# EasyEDA Pro project 15届省2.epro

# Schematic SCH

## Sheets
1 P1: Create Date: 2024-03-08; Page Name: P1; Project Name: 15P2D_EDA; Schematic Name: SCH; Update Date: 2024-04-16; Company: 嘉立创EDA; Page Size: A4; Version: V1.0
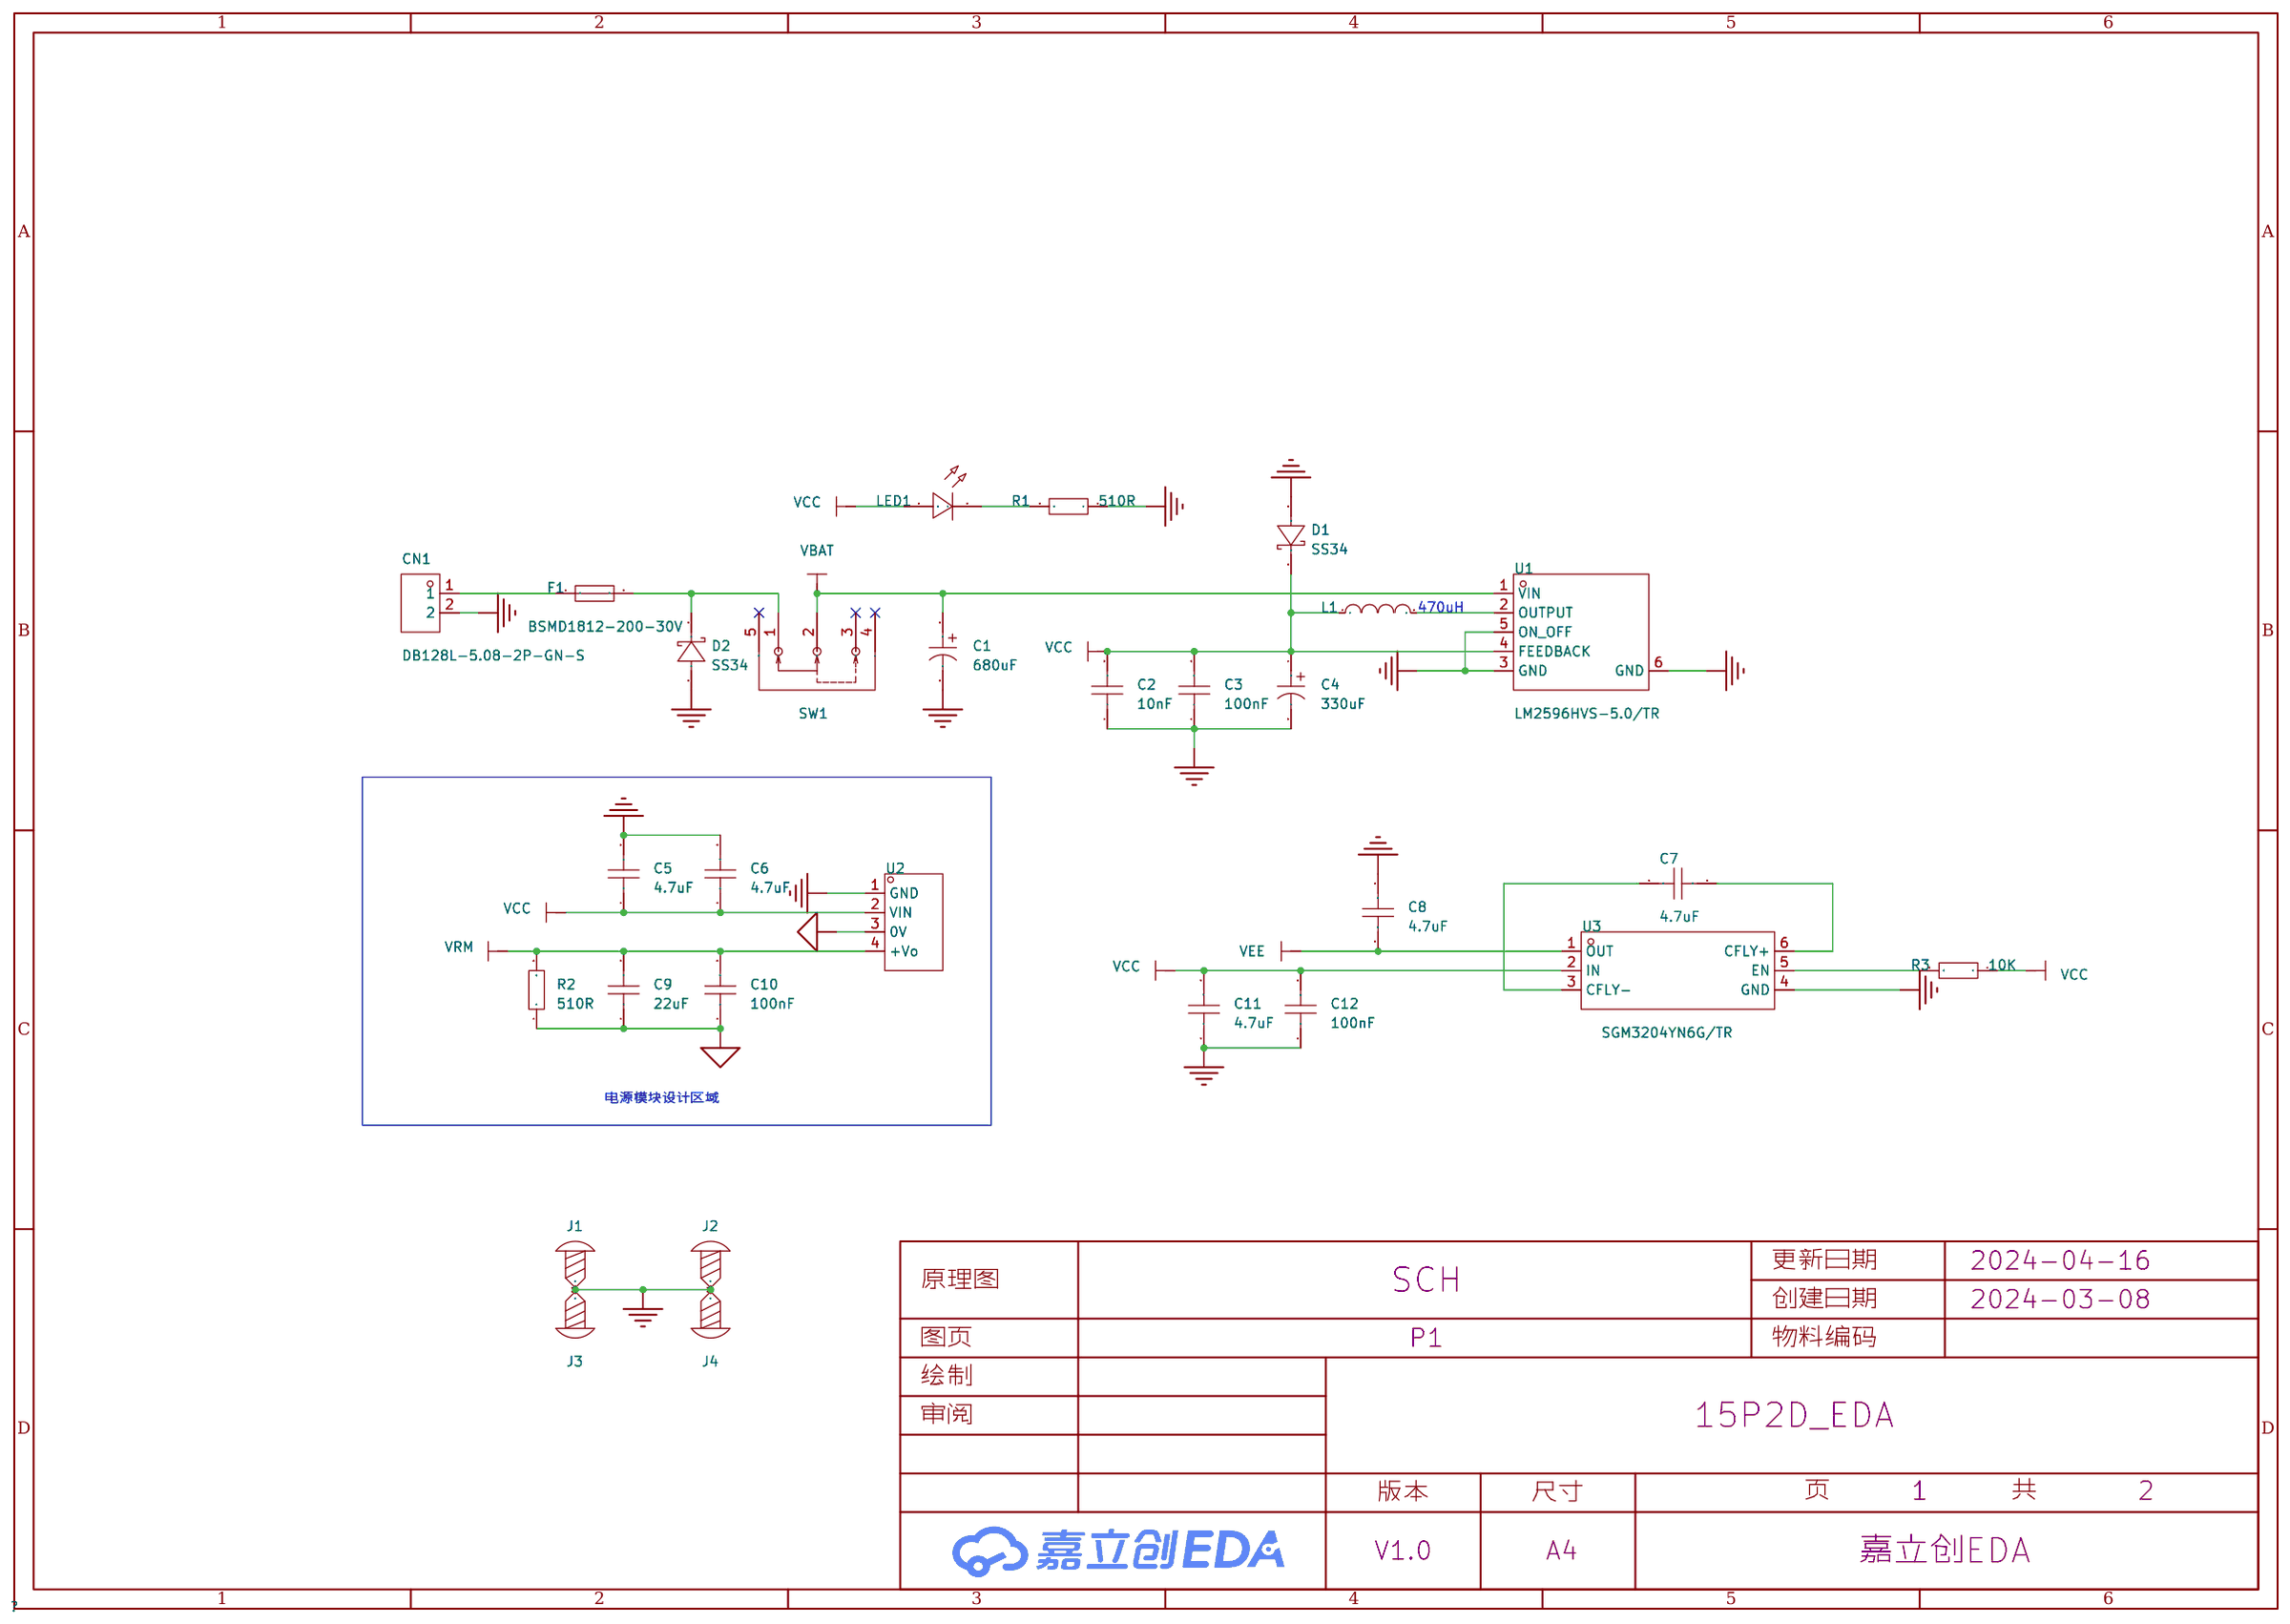
[diagram p0: P1]
2 P2: Create Date: 2024-03-11; Page Name: P2; Update Date: 2024-04-10; Company: EDA设计与开发
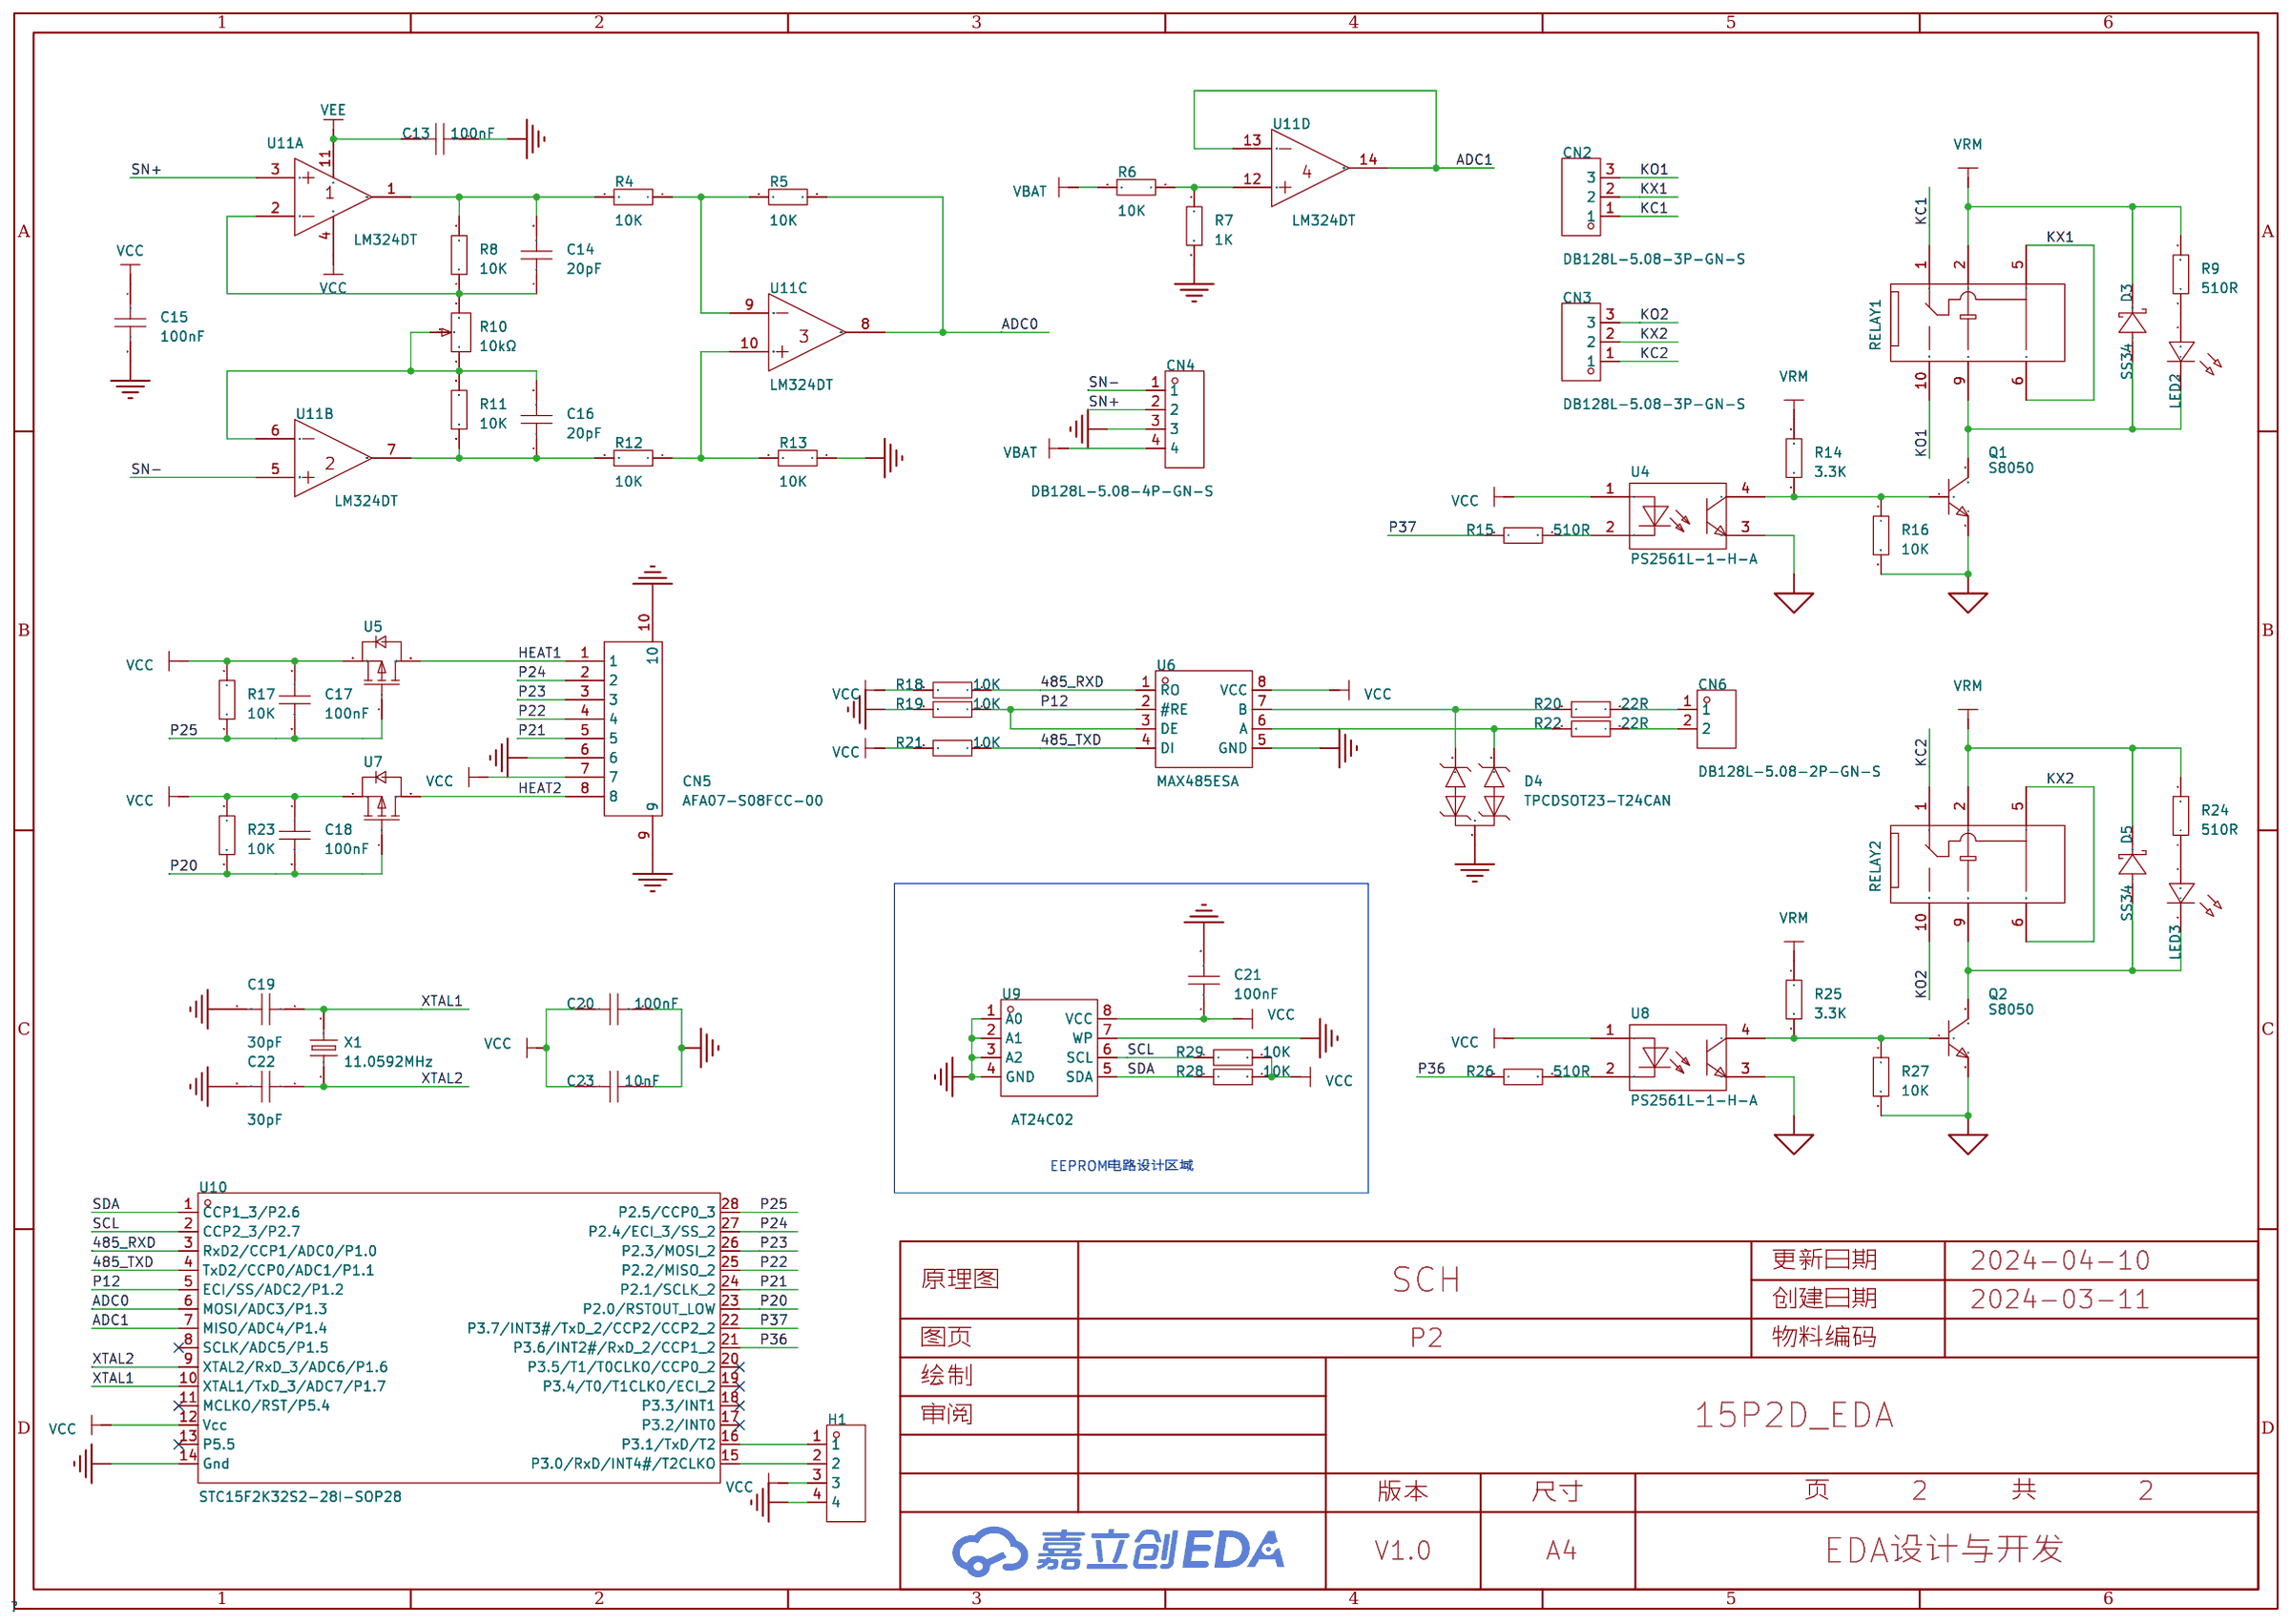
[diagram p1: P2]

## Parts
sheet P1
C1  680uF  [CAP-SMD_BD10.0-L10.3-W10.3-LS11.3-FD]
C2  10nF  [C0805]
C3  100nF  [C0805]
C4  330uF  [CAP-SMD_BD6.3-L6.6-W6.6-LS7.6-RD]
C5  4.7uF  [C1206]
C6  4.7uF  [C1206]
C7  4.7uF  [C1206]
C8  4.7uF  [C1206]
C9  22uF  [C1206]
C10  100nF  [C0805]
C11  4.7uF  [C1206]
C12  100nF  [C0805]
CN1  DB128L-5.08-2P-GN-S  [CONN-TH_2P-P5.08_DB128L-5.08-2P]
D1  SS34  [SMA_L4.3-W2.5-LS5.0-RD]
D2  SS34  [SMA_L4.3-W2.5-LS5.0-RD]
F1  BSMD1812-200-30V  [F1812]
J1  -  [M2螺丝]
J2  -  [M2螺丝]
J3  -  [M2螺丝]
J4  -  [M2螺丝]
L1  470uH  [IND-SMD_L12.0-W12.0_YPRH120X]
LED1  -  [LED_TH-3mm]
R1  510R  [R0805]
R2  510R  [R0805]
R3  10K  [R0805]
SW1  SK12D07VG4  [SW-TH_SK12D07VG4]
U1  LM2596HVS-5.0/TR  [TO-263-5_L10.2-W8.9-P1.70-LS15.2-BR]
U2  -  [TH_PCON]
U3  SGM3204YN6G/TR  [SOT-23-6_L2.9-W1.6-P0.95-LS2.8-BR]
sheet P2
C13  100nF  [C0805]
C14  20pF  [C0805]
C15  100nF  [C0805]
C16  20pF  [C0805]
C17  100nF  [C0805]
C18  100nF  [C0805]
C19  30pF  [C0805]
C20  100nF  [C0805]
C21  100nF  [C0805]
C22  30pF  [C0805]
C23  10nF  [C0805]
CN2  DB128L-5.08-3P-GN-S  [CONN-TH_DB128L-5.08-3P]
CN3  DB128L-5.08-3P-GN-S  [CONN-TH_DB128L-5.08-3P]
CN4  DB128L-5.08-4P-GN-S  [CONN-TH_4P_DB128L-5.08-4P-GN-S]
CN5  AFA07-S08FCC-00  [FPC-SMD_P1.00-8P_LCS-XJ-H2.5]
CN6  DB128L-5.08-2P-GN-S  [CONN-TH_2P-P5.08_DB128L-5.08-2P]
D3  SS34  [SMA_L4.3-W2.5-LS5.0-RD]
D4  TPCDSOT23-T24CAN  [SOT-23-3_L2.9-W1.3-P1.90-LS2.4-BR]
D5  SS34  [SMA_L4.3-W2.5-LS5.0-RD]
H1  -  [HDR-TH_4P-P2.54-V-F]
LED2  -  [LED_TH-3mm]
LED3  -  [LED_TH-3mm]
Q1  S8050  [SOT-23-3_L2.9-W1.3-P1.90-LS2.4-BR]
Q2  S8050  [SOT-23-3_L2.9-W1.3-P1.90-LS2.4-BR]
R4  10K  [R0805]
R5  10K  [R0805]
R6  10K  [R0805]
R7  1K  [R0805]
R8  10K  [R0805]
R9  510R  [R0805]
R10  10kΩ  [RES-ADJ-TH_3P-L10.0-W10.0-P2.50-BL-BS]
R11  10K  [R0805]
R12  10K  [R0805]
R13  10K  [R0805]
R14  3.3K  [R0805]
R15  510R  [R0805]
R16  10K  [R0805]
R17  10K  [R0805]
R18  10K  [R0805]
R19  10K  [R0805]
R20  22R  [R0805]
R21  10K  [R0805]
R22  22R  [R0805]
R23  10K  [R0805]
R24  510R  [R0805]
R25  3.3K  [R0805]
R26  510R  [R0805]
R27  10K  [R0805]
R28  10K  [R0805]
R29  10K  [R0805]
RELAY1  G5V-1 DC5  [RELAY-TH_G5V-1]
RELAY2  G5V-1 DC5  [RELAY-TH_G5V-1]
U4  PS2561L-1-H-A  [SOP-4_L6.5-W4.6-P2.54-LS9.6-TL]
U5  SI2301-ZE  [SOT-23-3_L2.9-W1.3-P1.90-LS2.4-BR]
U6  MAX485ESA  [SOP-8_L5.0-W4.0-P1.27-LS6.0-BL]
U7  SI2301-ZE  [SOT-23-3_L2.9-W1.3-P1.90-LS2.4-BR]
U8  PS2561L-1-H-A  [SOP-4_L6.5-W4.6-P2.54-LS9.6-TL]
U9  AT24C02  [SOP-8_L4.9-W3.9-P1.27-LS6.0-BL]
U10  STC15F2K32S2-28I-SOP28  [SOP-28_L17.9-W7.5-P1.27-LS10.3-BL]
U11  LM324DT  [SOIC-14_L8.7-W3.9-P1.27-LS6.0-BL]  (sections 1,2,3,4)
X1  11.0592MHz  [HC-49US_L11.5-W4.5-P4.88]

## Library data of the parts
C1 = 126RV0105: 容值:680uF;精度:±20%;额定电压:35V;纹波电流:380mA;; LCSC Part Name: 680uF ±20% 35V; Supplier Part: C7461236; Manufacturer: KNSCHA(科尼盛); Supplier Footprint: SMD,D10xL10.5mm; JLCPCB Part Class: Extended Part; Datasheet: https://atta.szlcsc.com/upload/public/pdf/source/20230711/6451BDCB5B323B6F7EF00B061BF0BEEC.pdf; Supplier: LCSC; Tolerance: ±20%; Rated Voltage: 35V; Ripple Current: 380mA; φD: 10mm; L: 10.5mm; Lifetime @ Temp: 2000hrs@105℃; Operating Temperature: -55℃~+105℃
C2 C3 C10 C12-C23 = CAP_0805: Supplier Footprint: 0805
C4 = 126RV0107: 容值:330uF;精度:±20%;额定电压:16V;纹波电流:170mA;; LCSC Part Name: 330uF ±20% 16V; Supplier Part: C7461238; Manufacturer: KNSCHA(科尼盛); Supplier Footprint: SMD,D6.3xL7.7mm; JLCPCB Part Class: Extended Part; Datasheet: https://atta.szlcsc.com/upload/public/pdf/source/20230711/6451BDCB5B323B6F7EF00B061BF0BEEC.pdf; Supplier: LCSC; Tolerance: ±20%; Rated Voltage: 16V; Ripple Current: 170mA; φD: 6.3mm; L: 7.7mm; Lifetime @ Temp: 2000hrs@105℃; Operating Temperature: -55℃~+105℃
C5-C9 C11 = CL31A226KOHNNNE: 容值:22uF;精度:±10%;额定电压:16V;材质(温度系数):X5R;; LCSC Part Name: 22uF ±10% 16V; Supplier Part: C90146; Manufacturer: SAMSUNG(三星); Supplier Footprint: 1206; JLCPCB Part Class: 扩展库; Datasheet: https://atta.szlcsc.com/upload/public/pdf/source/20161228/1482890861309.pdf; Supplier: LCSC; Tolerance: ±10%; Voltage Rated: 16V; Temperature Coefficient: X5R
CN1 CN6 = DB128L-5.08-2P-GN-S: 结构:1x2P;间距:5.08mm;颜色:绿色;安装方式:直插;额定电流:18A;额定电压:250V;排数:1;线规 - AWG:12~30;线规 - 平方毫米:2.5;每排PIN数:2;工作温度范围:-40℃~+105℃;; LCSC Part Name: 5.08mm 1x2P 排数:1 每排P数:2 直插; Supplier Part: C395868; Manufacturer: DORABO(地博电气); Supplier Footprint: 插件,P=5.08mm; JLCPCB Part Class: 扩展库; Datasheet: https://atta.szlcsc.com/upload/public/pdf/source/20230106/B067FE0E641A396A370D47F93C345689.pdf; Supplier: LCSC; Structure: 1x2P; Pitch: 5.08mm; Color: 绿色; Mounting Style: 直插; Current Rating (Max): 18A; Voltage Rating (Max): 250V; Number of Pins: 2P; Number of Rows: 1; Wire Gauge - AWG: 12~30; Wire Gauge - mm2: 2.5; Number of PINs Per Row: 2; Operating Temperature Range: -40℃~+105℃
D1-D3 D5 = SS34_C727060: 二极管配置:独立式;正向压降(Vf):550mV@3A;直流反向耐压(Vr):40V;平均整流电流(Io):3A;; LCSC Part Name: 电压:40V 电流:3A; Supplier Part: C727060; Manufacturer: TWGMC(台湾迪嘉); Supplier Footprint: SMA(DO-214AC); JLCPCB Part Class: 扩展库; Datasheet: https://atta.szlcsc.com/upload/public/pdf/source/20200828/C727059_6599B6CAC5F3238B9C33E46794659DBE.pdf; Supplier: LCSC; Diode Configuration: 独立式; Forward Voltage (Vf@If): 550mV@3A; Reverse Voltage (Vr): 40V; Average Rectified Current (Io): 3A; Reverse Leakage Current (Ir): 500uA@40V
F1 = BSMD1812-200-30V: 最大电压:30V;最大电流:40A;保持电流:2A;跳闸电流:4A;; LCSC Part Name: 30V 2A 1812自恢复; Supplier Part: C960026; Manufacturer: BHFUSE(佰宏); Supplier Footprint: 1812; JLCPCB Part Class: 扩展库; Datasheet: https://atta.szlcsc.com/upload/public/pdf/source/20230512/6ED7FF50F668B3AF958C55F12246A840.pdf; Supplier: LCSC; Operating Voltage (Max): 30V; Current Rating (Max): 40A; Hold Current: 2A; Trip Current: 4A; Power Dissipation: 1W; Resistance - Initial (Ri) (Min): 20mΩ; Resistance - Post Trip (R1) (Max): 100mΩ; Maximum Time to Trip: 2s; Operating Temperature: -40℃~+85℃
J1-J4 = M2螺丝: Supplier Footprint: 插件
L1 = YPRH1209-471M: 电感值:470uH;精度:±20%;额定电流:1.06A;; LCSC Part Name: 470uH ±20%; Supplier Part: C718309; Manufacturer: YJYCOIN(益嘉源); Supplier Footprint: SMD,12x12mm; JLCPCB Part Class: 扩展库; Datasheet: https://atta.szlcsc.com/upload/public/pdf/source/20200623/C339955_D39FA66995A9BB8553FDBD7D9E6E5CB5.pdf; Supplier: LCSC; Tolerance: ±20%; Rated Current: 1.06A; DC Resistance (DCR): 471mΩ
LED1 = LED_TH-R_3mm: Supplier Footprint: 插件
R1-R9 R11-R29 = Res_0805: Supplier Footprint: 0805
SW1 = SK12D07VG4: 电路结构:单刀双掷;安装方式:侧插;额定电流(DC):500mA;额定电压(DC):50V;额定电流(AC):-;额定电压(AC):-;机械寿命:5千次;; LCSC Part Name: 3脚2档位 卧插 滑动开关; Supplier Part: C393937; Manufacturer: SHOU HAN(首韩); Supplier Footprint: 插件; JLCPCB Part Class: 扩展库; Datasheet: https://atta.szlcsc.com/upload/public/pdf/source/20190521/C393937_939FE26E571CC67D2D532E953108A1B0.pdf; Supplier: LCSC; Circuit: 单刀双掷; Actuator Style: 矩形柱状; Pin Style: PC引脚; Switch Height: 8.8mm; Mounting Style: 侧插; Current Rating (DC): 500mA; Voltage Rating (DC): 50V; Mechanical Life: 5千次
U1 = LM2596HVS-5.0/TR: Supplier Part: C7421039; Manufacturer: HGSEMI(华冠); Supplier Footprint: TO-263-5; Datasheet: https://atta.szlcsc.com/upload/public/pdf/source/20230608/50F81A07F1CB4120FC66F79925E72406.pdf; Supplier: LCSC
U2 = PCON
U3 = SGM3204YN6G/TR: 功能类型:-;输入电压:1.4V~5.5V;输出电压:-5.5V~-1.4V;输出电流(最大值):200mA;; Supplier Part: C194031; Manufacturer: SGMICRO(圣邦微); Supplier Footprint: SOT-23-6; JLCPCB Part Class: 扩展库; Datasheet: https://atta.szlcsc.com/upload/public/pdf/source/20180627/C194031_755051E53122D645C36CF727711B963E.pdf; Supplier: LCSC; Input Voltage: 1.4V~5.5V; Output Voltage: -5.5V~-1.4V; Output Current (Max): 200mA; Switching Frequency: 950kHz; Number of Outputs: 1; Switch tube (built-in/external): 内置
CN2 CN3 = DB128L-5.08-3P-GN-S: 结构:1x3P;间距:5.08mm;颜色:绿色;安装方式:直插;额定电流:18A;额定电压:250V;排数:1;线规 - AWG:12~30;线规 - 平方毫米:2.5;每排PIN数:3;工作温度范围:-40℃~+105℃;; LCSC Part Name: 5.08mm 1x3P 排数:1 每排P数:3 直插; Supplier Part: C395869; Manufacturer: DORABO(地博电气); Supplier Footprint: 插件,P=5.08mm; JLCPCB Part Class: 扩展库; Datasheet: https://atta.szlcsc.com/upload/public/pdf/source/20230106/B067FE0E641A396A370D47F93C345689.pdf; Supplier: LCSC; Structure: 1x3P; Pitch: 5.08mm; Color: 绿色; Mounting Style: 直插; Current Rating (Max): 18A; Voltage Rating (Max): 250V; Number of Pins: 3P; Number of Rows: 1; Wire Gauge - AWG: 12~30; Wire Gauge - mm2: 2.5; Number of PINs Per Row: 3; Operating Temperature Range: -40℃~+105℃
CN4 = DB128L-5.08-4P-GN-S: 结构:1x4P;间距:5.08mm;颜色:绿色;安装方式:直插;额定电流:18A;额定电压:250V;排数:1;线规 - AWG:12~30;线规 - 平方毫米:2.5;每排PIN数:4;工作温度范围:-40℃~+105℃;; LCSC Part Name: 5.08mm 1x4P 排数:1 每排P数:4 直插; Supplier Part: C2827883; Manufacturer: DORABO(地博电气); Supplier Footprint: 插件,P=5.08mm; JLCPCB Part Class: 扩展库; Datasheet: https://atta.szlcsc.com/upload/public/pdf/source/20230106/B067FE0E641A396A370D47F93C345689.pdf; Supplier: LCSC; Structure: 1x4P; Pitch: 5.08mm; Color: 绿色; Mounting Style: 直插; Current Rating (Max): 18A; Voltage Rating (Max): 250V; Number of Pins: 4P; Number of Rows: 1; Wire Gauge - AWG: 12~30; Wire Gauge - mm2: 2.5; Number of PINs Per Row: 4; Operating Temperature Range: -40℃~+105℃
CN5 = AFA07-S08FCC-00: 锁定特性:抽屉式;触点类型:下接;触点数量:8P;间距:1mm;安装类型:卧贴;; LCSC Part Name: 间距:1mm P数:8P 抽屉式 下接; Supplier Part: C262342; Manufacturer: JS(钜硕电子); Supplier Footprint: SMD,P=1mm,卧贴; JLCPCB Part Class: 扩展库; Datasheet: https://atta.szlcsc.com/upload/public/pdf/source/20191217/C262716_30B15E9A77BFCA4A54741C92DB3BE8CC.pdf; Supplier: LCSC; Locking Feature: 抽屉式; Contact Type: 下接; Number of Contacts: 8P; Pitch: 1mm; Mounting Type: 卧贴; FFC, FCB Thickness: 0.3mm; Height Above Board: 2.5mm
D4 = TPCDSOT23-T24CAN: Supplier Part: C970033; Manufacturer: TECH PUBLIC(台舟); Supplier Footprint: SOT-23; JLCPCB Part Class: 扩展库; Datasheet: https://atta.szlcsc.com/upload/public/pdf/source/20230522/C1F3B36253468277A14BE124FFAB154C.pdf; Supplier: LCSC
H1 = HDR-F_2.54_1x4P: Supplier Part: C2718488; Supplier Footprint: 插件
LED2 LED3 = LED_TH-G_3mm: Supplier Footprint: 插件
Q1 Q2 = S8050_C2891804: 晶体管类型:NPN;集电极电流(Ic):500mA;集射极击穿电压(Vceo):25V;功率(Pd):300mW;; LCSC Part Name: NPN 电流:500mA 耐压:25V; Supplier Part: C2891804; Manufacturer: YONGYUTAI(永裕泰); Supplier Footprint: SOT-23; JLCPCB Part Class: Extended Part; Datasheet: https://atta.szlcsc.com/upload/public/pdf/source/20210901/5347316A10609C628D4D69AE01446E5B.pdf; Supplier: LCSC; Transistor Type: NPN; Collector Current (Ic): 500mA; Collector-Emitter Breakdown Voltage (Vceo): 25V; Power Dissipation (Pd): 300mW; Collector Cut-Off Current (Icbo): 1uA; Collector-Emitter Saturation Voltage (VCE(sat)@Ic,Ib): 500mV@500mA,50mA
R10 = 3296W-1-203LF: 阻值:20kΩ;精度:±10%;功率:500mW;温度系数:±100ppm/℃;; LCSC Part Name: 20kΩ ±10%; Supplier Part: C34845; Manufacturer: BOURNS; Supplier Footprint: 插件; JLCPCB Part Class: 扩展库; Datasheet: https://atta.szlcsc.com/upload/public/pdf/source/20151026/1457707506403.pdf; Supplier: LCSC; Tolerance: ±10%; Power(Watts): 500mW; Temperature Coefficient: ±100ppm/℃; Turns: 25
RELAY1 RELAY2 = G5V-1 DC5: 线圈电压:5V;触点形式:一组转换:1C(单刀双掷-转换);触点容量(电阻负载):-;最大切换电压:125V@AC；60V@DC;最大切换电流:1A;; LCSC Part Name: 继电器G5V-1-5VDC; Supplier Part: C28695; Manufacturer: OMRON(欧姆龙); Supplier Footprint: DIP,7.5x12.5mm; JLCPCB Part Class: 扩展库; Supplier: LCSC; Coil Voltage: 5V; Contact Form: 一组转换:1C(单刀双掷-转换); Maximum Switching Voltage: 125V@AC；60V@DC; Contact Material: 银+镀金; Maximum Switching Current: 1A; Operate Time: 5ms; Release Time: 5ms; Operating Temperature: -40℃~+70℃
U4 U8 = PS2561L-1-H-A: Supplier Part: C145672; Manufacturer: California Eastern Laboratories; Supplier Footprint: SOP-4-2.54mm; JLCPCB Part Class: 扩展库; Datasheet: https://atta.szlcsc.com/upload/public/pdf/source/20180125/C145673_15168615431091301608.pdf; Supplier: LCSC
U5 U7 = SI2301-ZE: 类型:P沟道;漏源电压(Vdss):20V;连续漏极电流(Id):2.3A;功率(Pd):700mW;导通电阻(RDS(on)@Vgs,Id):126mΩ@4.5V;阈值电压(Vgs(th)@Id):1V@250uA;; LCSC Part Name: P沟道 耐压:20V 电流:2.3A; Supplier Part: C5261052; Manufacturer: HXY MOSFET(华轩阳电子); Supplier Footprint: SOT-23; JLCPCB Part Class: 扩展库; Datasheet: https://atta.szlcsc.com/upload/public/pdf/source/20230515/2FF2907841563ED329594D3237822724.pdf; Supplier: LCSC; Type: P沟道; Drain Source Voltage (Vdss): 20V; Continuous Drain Current (Id): 2.3A; Power Dissipation (Pd): 700mW; Drain Source On Resistance (RDS(on)@Vgs,Id): 126mΩ@4.5V; Gate Threshold Voltage (Vgs(th)@Id): 1V@250uA; Input Capacitance (Ciss@Vds): 285pF
U6 = MAX485ESA_C668206: Supplier Part: C668206; Manufacturer: UMW(友台半导体); Supplier Footprint: SOP-8; JLCPCB Part Class: 扩展库; Datasheet: https://atta.szlcsc.com/upload/public/pdf/source/20231109/489730AE87B90C4B6B8CE65C07B1054C.pdf; Supplier: LCSC
U9 = AT24C02_C7470930: 接口类型:I2C;存储容量:2Kbit;时钟频率(fc):400kHz~1MHz;; LCSC Part Name: AT24C02  2Kbit 12C; Supplier Part: C7470930; Manufacturer: HXY MOSFET(华轩阳电子); Supplier Footprint: SOP-8; JLCPCB Part Class: 扩展库; Datasheet: https://atta.szlcsc.com/upload/public/pdf/source/20230913/748AF0FF0068DF582FAC58AD968E8A28.pdf; Supplier: LCSC; Interface Type: I2C; Memory Size: 2Kbit; Clock Frequency (fc): 400kHz~1MHz; Supply Voltage: 1.8V~5.5V; Data Retention - TDR (Year): 100年
U10 = STC15F2K32S2-28I-SOP28: LCSC Part Name: STC15F2K32S2-28I- SOP28; Supplier Part: C194605; Manufacturer: STC(宏晶); Supplier Footprint: SOP-28-300mil; JLCPCB Part Class: 扩展库; Datasheet: https://atta.szlcsc.com/upload/public/pdf/source/20180730/C194606_29BB2C4DE21484D9E9511E7CB40FB26F.pdf; Supplier: LCSC
U11 = LM324DT: 放大器数:四路;增益带宽积(GBP):1.3MHz;输入偏置电流(Ib):20nA;压摆率(SR):0.4V/us;带宽(-3db):-;; Supplier Part: C71035; Manufacturer: ST(意法半导体); Supplier Footprint: SOIC-14; JLCPCB Part Class: 基础库; Datasheet: https://atta.szlcsc.com/upload/public/pdf/source/20160408/1460100649718.pdf; Supplier: LCSC; Number of Circuits: 四路; Gain Bandwidth Product(GBP): 1.3MHz; Current - Input Bias(Ib): 20nA; Slew Rate(SR): 0.4V/us; Output Current: 40mA; Supply Current: 1.5mA; Operating Temperature: 0℃~+70℃
X1 = TAXD11.0592M2GLFBET2T: 晶振类型:直插晶振;频率:11.0592MHz;常温频差:±30ppm;外接负载电容:20pF;频率稳定度(全温):±30ppm;; LCSC Part Name: 11.0592MHz ±30ppm 20pF; Supplier Part: C127675; Manufacturer: YJX(雅晶鑫); Supplier Footprint: HC-49S; JLCPCB Part Class: 扩展库; Datasheet: https://atta.szlcsc.com/upload/public/pdf/source/20170914/C127676_1505359415156967690.pdf; Supplier: LCSC; Crystal Type: 直插晶振; Normal temperature Frequency Tolerance: ±30ppm; External load capacitor: 20pF; Frequency Stability(Full temperature range): ±30ppm; Equivalent Series Resistance (ESR): 50Ω; Operating Temperature: -20℃~+70℃

## Nets
GND: C1.2 C2.1 C3.1 C4.2 C5.2 C6.2 C8.1 C11.1 C12.1 C13.1 C15.2 C19.2 C20.1 C21.2 C22.2 C23.1 CN1.2 CN4.3 CN5.6 CN5.9 CN5.10 D1.2(A) D2.2(A) D4.3 H1.4 J1.1 J2.1 J3.1 J4.1 R1.1 R7.2 R13.1 R19.2 U1.3(GND) U1.5(ON_OFF) U1.6(GND) U2.1(GND) U3.4(GND) U6.5(GND) U9.1(A0) U9.2(A1) U9.3(A2) U9.4(GND) U9.7(WP) U10.14(Gnd)
VBAT: C1.1 CN4.4 R6.2 SW1.2 U1.1(VIN)
VCC: C2.2 C3.2 C4.1 C5.1 C6.1 C11.2 C12.2 C15.1 C17.1 C18.1 C20.2 C21.1 C23.2 CN5.7 D1.1(C) H1.3 L1.1 LED1.1(C) R3.1 R17.1 R18.2 R21.2 R23.1 R28.2 R29.2 U1.4(FEEDBACK) U2.2(VIN) U3.2(IN) U4.1 U5.2(S) U6.8(VCC) U7.2(S) U8.1 U9.8(VCC) U10.12(Vcc) U11.4(VCC+)
VEE: C8.2 C13.2 U3.1(OUT) U11.11(VCC-)
0: C9.1 C10.1 Q1.2(E) Q2.2(E) R2.1 R16.2 R27.2 U2.3(0V) U4.3 U8.3
485_RXD: R18.1 U6.1(RO) U10.3(RxD2/CCP1/ADC0/P1.0)
485_TXD: R21.1 U6.4(DI) U10.4(TxD2/CCP0/ADC1/P1.1)
ADC0: R5.1 U10.6(MOSI/ADC3/P1.3) U11.8(OUT3)
ADC1: U10.7(MISO/ADC4/P1.4) U11.13(IN4-) U11.14(OUT4)
HEAT1: CN5.1 U5.3(D)
HEAT2: CN5.8 U7.3(D)
KC1: CN2.1 RELAY1.1
KC2: CN3.1 RELAY2.1
KO1: CN2.3 RELAY1.10
KO2: CN3.3 RELAY2.10
KX1: CN2.2 RELAY1.5 RELAY1.6
KX2: CN3.2 RELAY2.5 RELAY2.6
P12: R19.1 U6.2(#RE) U6.3(DE) U10.5(ECI/SS/ADC2/P1.2)
P20: C18.2 R23.2 U7.1(G) U10.23(P2.0/RSTOUT_LOW)
P21: CN5.5 U10.24(P2.1/SCLK_2)
P22: CN5.4 U10.25(P2.2/MISO_2)
P23: CN5.3 U10.26(P2.3/MOSI_2)
P24: CN5.2 U10.27(P2.4/ECI_3/SS_2)
P25: C17.2 R17.2 U5.1(G) U10.28(P2.5/CCP0_3)
P36: R26.1 U10.21(P3.6/INT2#/RxD_2/CCP1_2)
P37: R15.1 U10.22(P3.7/INT3#/TxD_2/CCP2/CCP2_2)
SCL: R29.1 U9.6(SCL) U10.2(CCP2_3/P2.7)
SDA: R28.1 U9.5(SDA) U10.1(CCP1_3/P2.6)
SN+: CN4.2 U11.3(IN1+)
SN-: CN4.1 U11.5(IN2+)
VRM: C9.2 C10.2 D3.1(C) D5.1(C) R2.2 R9.2 R14.1 R24.2 R25.1 RELAY1.2 RELAY2.2 U2.4(+Vo)
XTAL1: C19.1 U10.10(XTAL1/TxD_3/ADC7/P1.7) X1.2
XTAL2: C22.1 U10.9(XTAL2/RxD_3/ADC6/P1.6) X1.1
$1N5406: CN1.1 F1.1
$1N6010: L1.2 U1.2(OUTPUT)
$1N7874: R3.2 U3.5(EN)
$1N8048: C7.2 U3.6(CFLY+)
$1N8053: C7.1 U3.3(CFLY-)
$1N8284: LED1.2(A) R1.2
$1N8627: D2.1(C) F1.2 SW1.1
$2N2031: C16.1 R11.1 R12.2 U11.7(OUT2)
$2N2092: R12.1 R13.2 U11.10(IN3+)
$2N2099: R4.1 R5.2 U11.9(IN3-)
$2N2266: C14.1 R8.1 R10.1 U11.2(IN1-)
$2N2273: C14.2 R4.2 R8.2 U11.1(OUT1)
$2N2314: C16.2 R10.2 R10.3 R11.2 U11.6(IN2-)
$2N3023: CN6.1 R20.1
$2N3053: CN6.2 R22.1
$2N3244: D4.1 R22.2 U6.6(A)
$2N3251: D4.2 R20.2 U6.7(B)
$2N3377: R15.2 U4.2
$2N3466: Q1.1(B) R14.2 R16.1 U4.4
$2N4164: R26.2 U8.2
$2N4168: Q2.1(B) R25.2 R27.1 U8.4
$2N4738: LED2.1(C) R9.1
$2N4742: D3.2(A) LED2.2(A) Q1.3(C) RELAY1.9
$2N4893: LED3.1(C) R24.1
$2N4914: D5.2(A) LED3.2(A) Q2.3(C) RELAY2.9
$2N5025: R6.1 R7.1 U11.12(IN4+)
$2N7138: H1.1 U10.16(P3.1/TxD/T2)
$2N7141: H1.2 U10.15(P3.0/RxD/INT4#/T2CLKO)

Not connected (* = marked no-connect by the designer): SW1 3* 4* 5*; U10 8(SCLK/ADC5/P1.5)* 11(MCLKO/RST/P5.4)* 13(P5.5)* 17(P3.2/INT0)* 18(P3.3/INT1)* 19(P3.4/T0/T1CLKO/ECI_2)* 20(P3.5/T1/T0CLKO/CCP0_2)*

## Notes on the sheets
sheet 1
- 电源模块设计区域
sheet 2
- EEPROM电路设计区域

# Board PCB
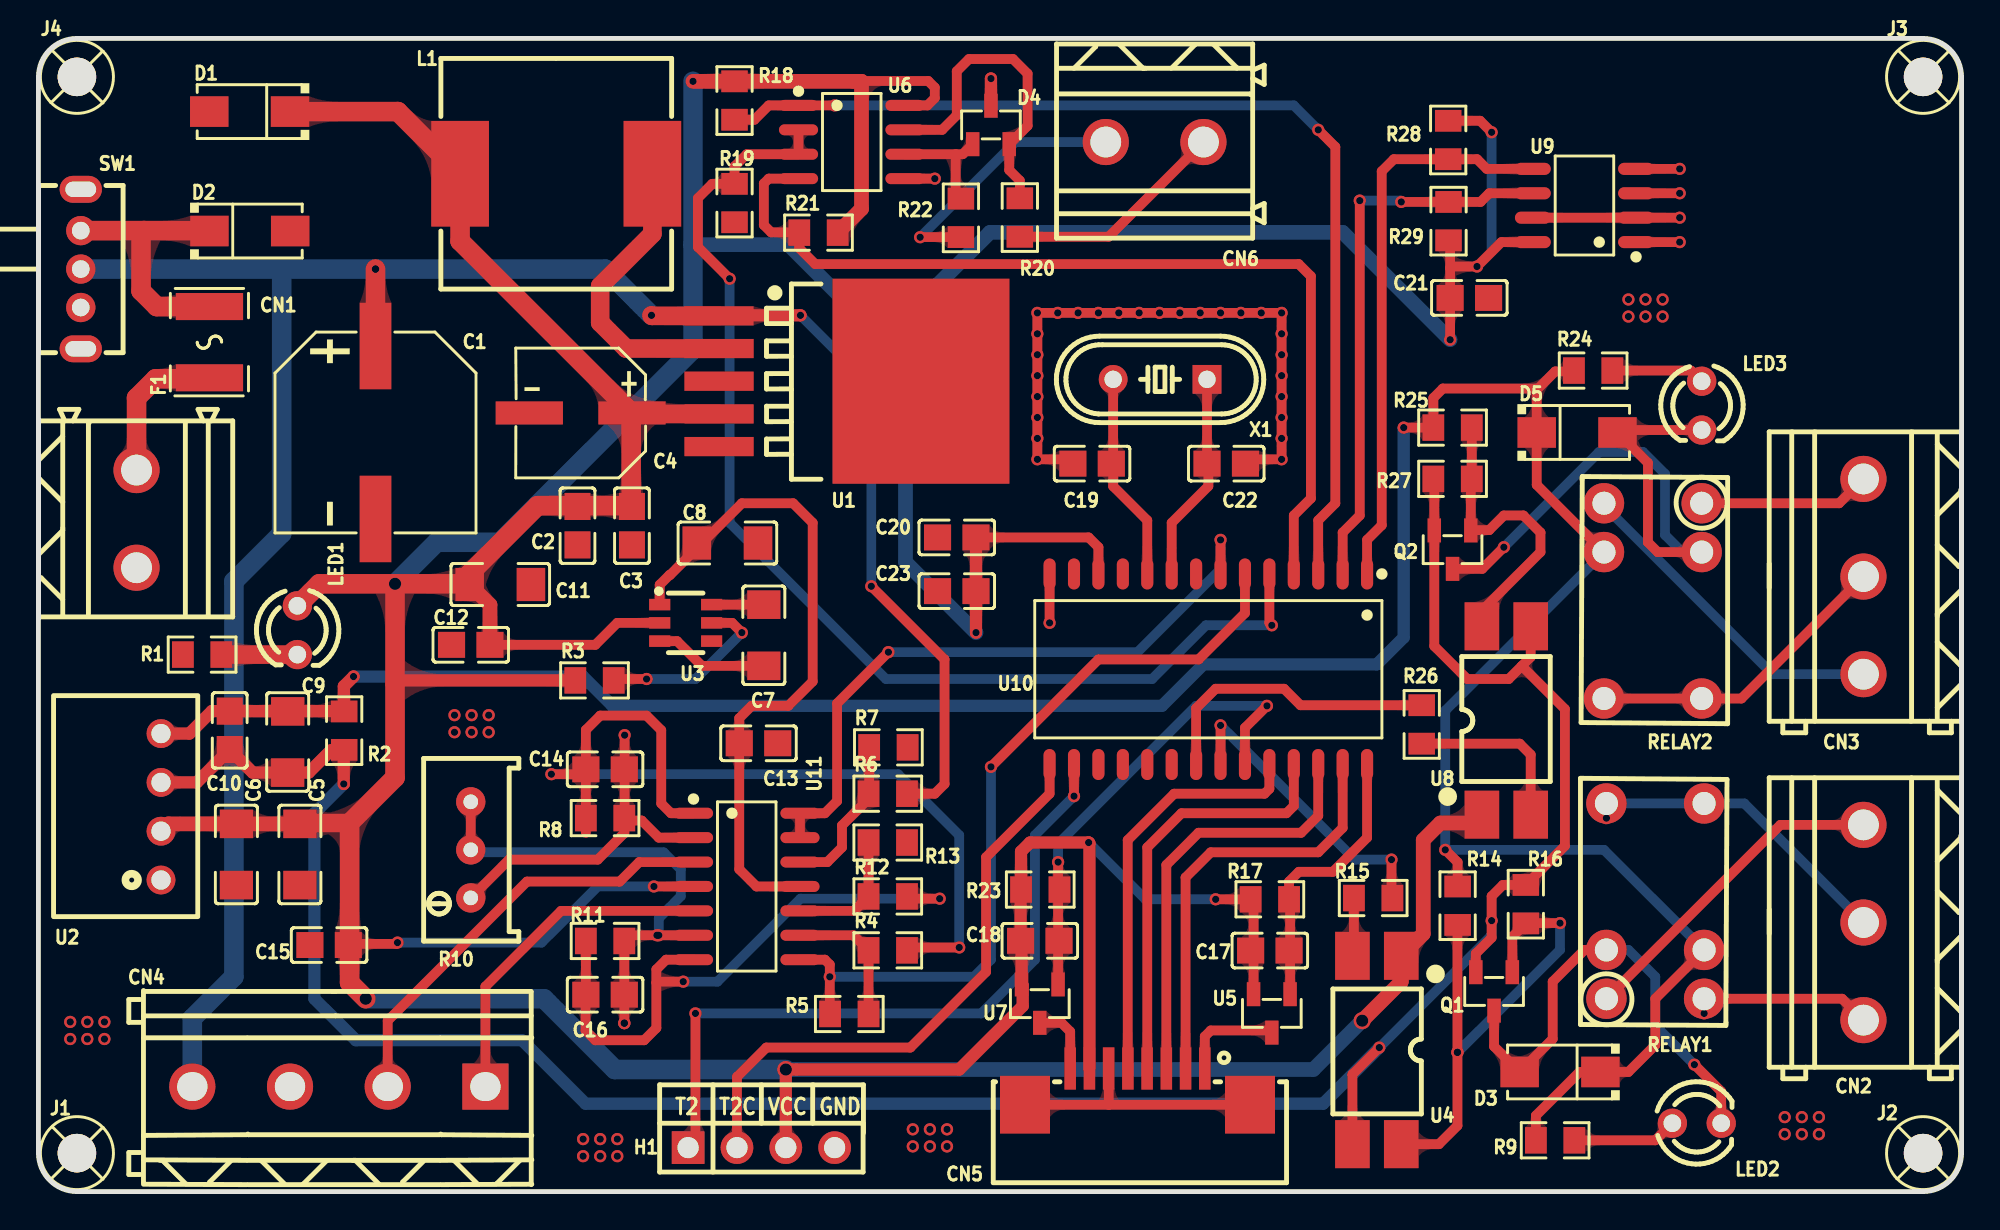
[diagram p2: board, top side]
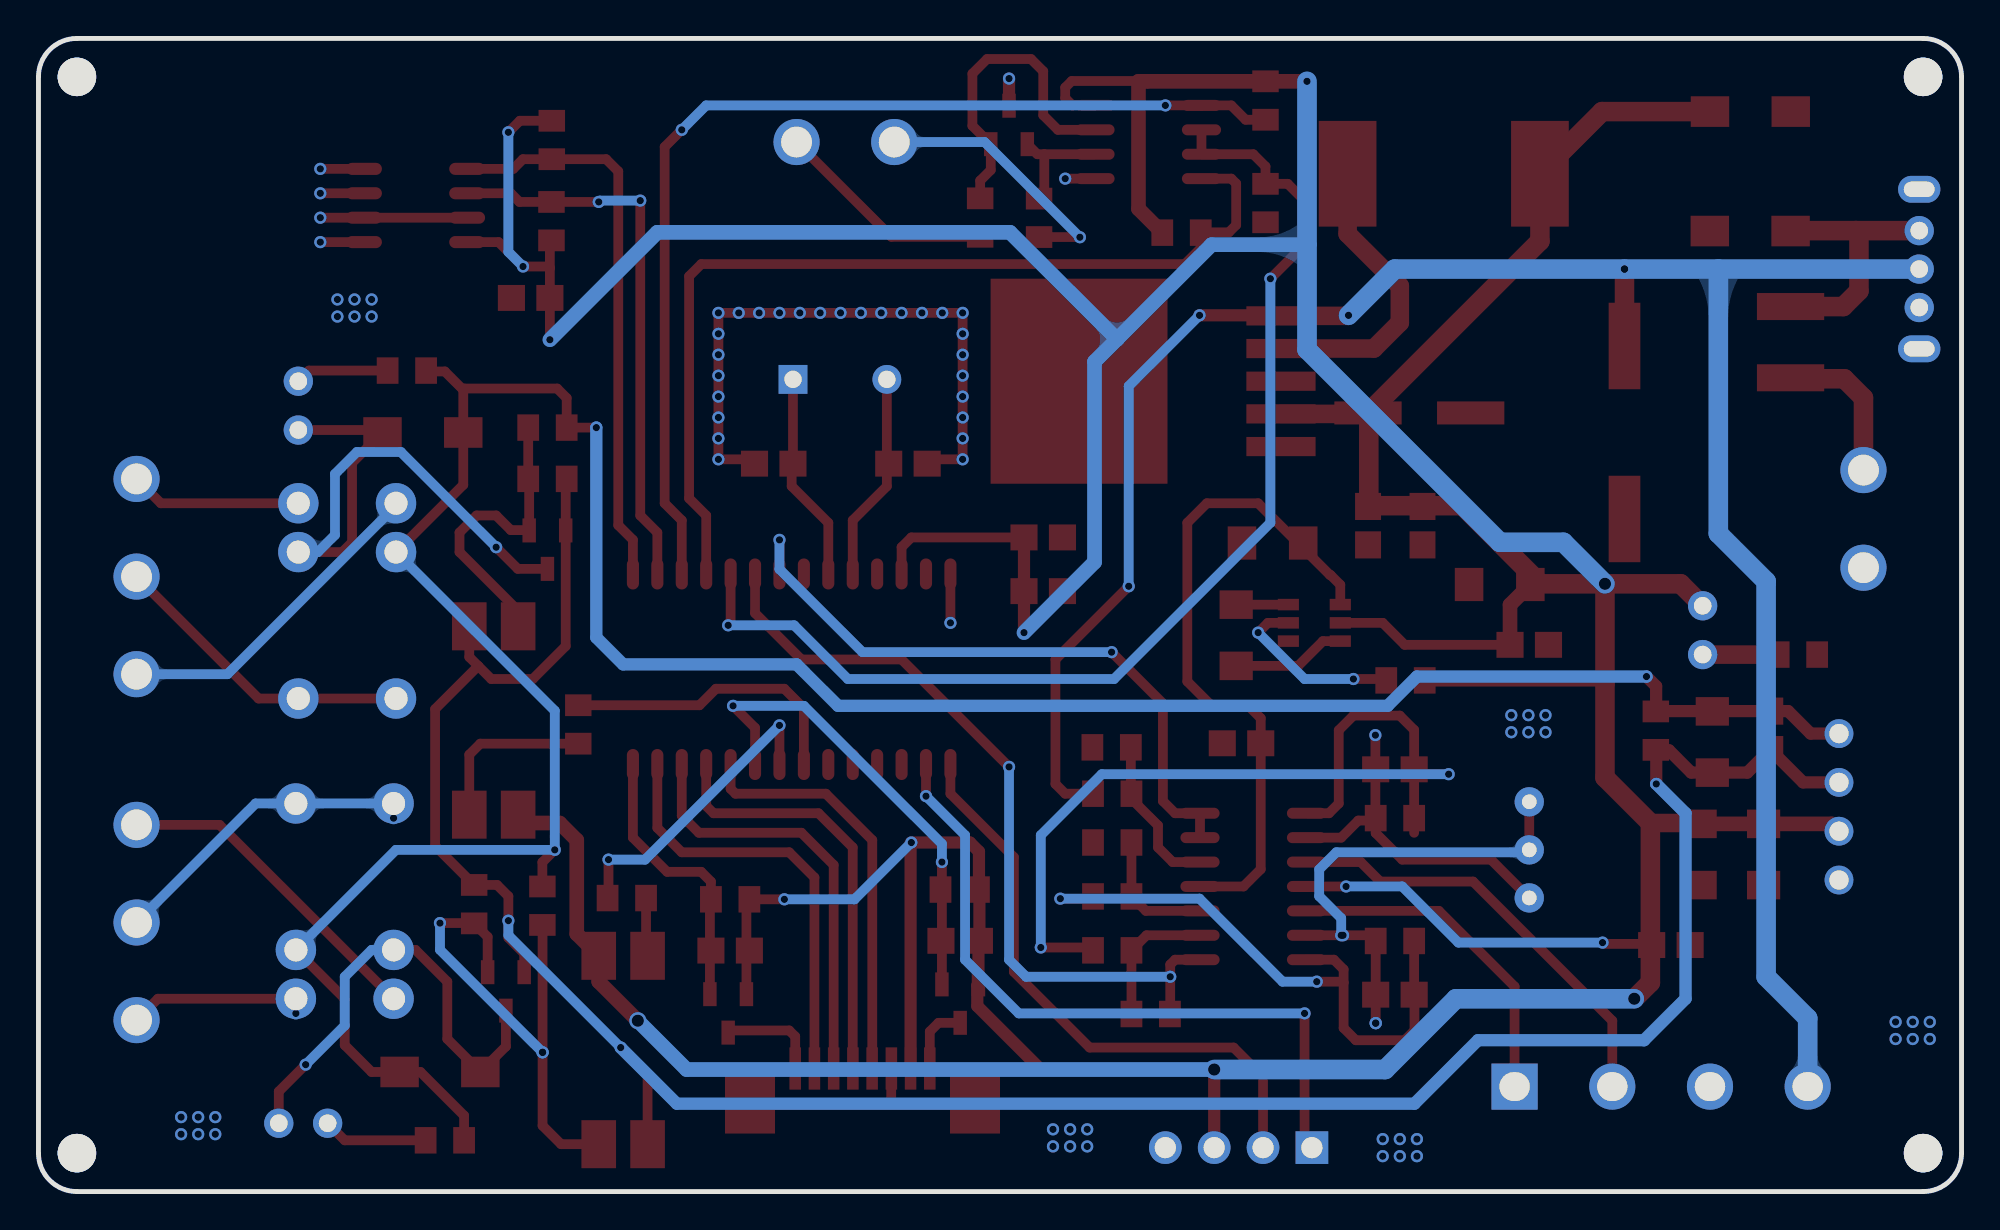
[diagram p3: board, bottom side, seen from below]

Outline 100 x 60 mm; copper layers: Top Layer, Bottom Layer. Coordinates in mm from the lower left corner of the outline.
Outline path: 0,58 0,2 arc(0.59,0.59) 2,0 98,0 arc(99.41,0.59) 100,2 100,58 arc(99.41,59.41) 98,60 2,60 arc(0.59,59.41) 0,58
Stack: Top Layer 0.035mm / Dielectric1 1.51mm FR4 er 4.5 / Bottom Layer 0.035mm

## Design rules (mm)
net XTAL2: DP1
net XTAL1: DP1
template: 自定义配置
spacing copperThickness1oz (default): track to track 0.203, other pairs 0.178 to 0.203
spacing copperThickness2oz: track to track 0.203, other pairs 0.152 to 0.3
track width copperThickness1oz (default): min 0.254, default 0.254, max 2.54
track width copperThickness2oz: min 0.203, default 0.254, max 2.54
differential pair differentialPair (default): width min 0.127, default 0.254, max 2.54; gap min 0.152, default 0.152
via viaSize (default): diameter min 0.635, default 0.66, max 10; hole min 0.381, default 0.508, max 6.299

## Placement (name value [footprint] x y rotation side)
C1  680uF  [CAP-SMD_BD10.0-L10.3-W10.3-LS11.3-FD]  17.53 39.5 270 top
C2  10nF  [C0805]  28.03 34.65 90 top
C3  100nF  [C0805]  30.86 34.65 90 top
C4  330uF  [CAP-SMD_BD6.3-L6.6-W6.6-LS7.6-RD]  28.19 40.51 180 top
C5  4.7uF  [C1206]  13.59 17.54 270 top
C6  4.7uF  [C1206]  10.29 17.54 270 top
C7  4.7uF  [C1206]  37.72 28.95 90 top
C8  4.7uF  [C1206]  35.83 33.75 180 top
C9  22uF  [C1206]  12.96 23.39 90 top
C10  100nF  [C0805]  9.94 24 90 top
C11  4.7uF  [C1206]  24.01 31.59 180 top
C12  100nF  [C0805]  22.48 28.45 0 top
C13  100nF  [C0805]  37.44 23.33 180 top
C14  20pF  [C0805]  29.46 21.97 180 top
C15  100nF  [C0805]  15.11 12.83 180 top
C16  20pF  [C0805]  29.46 10.24 0 top
C17  100nF  [C0805]  64.03 12.54 0 top
C18  100nF  [C0805]  52.07 13.05 0 top
C19  30pF  [C0805]  54.79 37.88 180 top
C20  100nF  [C0805]  47.75 34.04 0 top
C21  100nF  [C0805]  74.41 46.5 0 top
C22  30pF  [C0805]  61.77 37.88 0 top
C23  10nF  [C0805]  47.75 31.24 0 top
CN1  DB128L-5.08-2P-GN-S  [CONN-TH_2P-P5.08_DB128L-5.08-2P]  5.1 35 270 top
CN2  DB128L-5.08-3P-GN-S  [CONN-TH_DB128L-5.08-3P]  94.9 14 90 top
CN3  DB128L-5.08-3P-GN-S  [CONN-TH_DB128L-5.08-3P]  94.9 32 90 top
CN4  DB128L-5.08-4P-GN-S  [CONN-TH_4P_DB128L-5.08-4P-GN-S]  15.62 5.46 0 top
CN5  AFA07-S08FCC-00  [FPC-SMD_P1.00-8P_LCS-XJ-H2.5]  57.15 5.46 180 top
CN6  DB128L-5.08-2P-GN-S  [CONN-TH_2P-P5.08_DB128L-5.08-2P]  58.04 54.61 180 top
D1  SS34  [SMA_L4.3-W2.5-LS5.0-RD]  10.98 56.19 180 top
D2  SS34  [SMA_L4.3-W2.5-LS5.0-RD]  10.99 49.98 0 top
D3  SS34  [SMA_L4.3-W2.5-LS5.0-RD]  79.12 6.22 180 top
D4  TPCDSOT23-T24CAN  [SOT-23-3_L2.9-W1.3-P1.90-LS2.4-BR]  49.53 55.5 270 top
D5  SS34  [SMA_L4.3-W2.5-LS5.0-RD]  80.01 39.5 0 top
F1  BSMD1812-200-30V  [F1812]  8.89 44.2 90 top
H1  -  [HDR-TH_4P-P2.54-V-F]  37.59 2.29 0 top
J1  -  [M2螺丝]  2 2 0 top
J2  -  [M2螺丝]  98 2 0 top
J3  -  [M2螺丝]  98 58 0 top
J4  -  [M2螺丝]  2 58 0 top
L1  470uH  [IND-SMD_L12.0-W12.0_YPRH120X]  26.92 52.96 0 top
LED1  -  [LED_TH-3mm]  13.46 29.21 270 top
LED2  -  [LED_TH-3mm]  86.23 3.56 0 top
LED3  -  [LED_TH-3mm]  86.49 40.89 270 top
Q1  S8050  [SOT-23-3_L2.9-W1.3-P1.90-LS2.4-BR]  75.69 10.41 90 top
Q2  S8050  [SOT-23-3_L2.9-W1.3-P1.90-LS2.4-BR]  73.53 33.4 90 top
R1  510R  [R0805]  8.51 27.94 0 top
R2  510R  [R0805]  15.9 23.98 90 top
R3  10K  [R0805]  28.91 26.6 0 top
R4  10K  [R0805]  44.16 12.55 0 top
R5  10K  [R0805]  42.16 9.24 0 top
R6  10K  [R0805]  44.16 20.7 0 top
R7  1K  [R0805]  44.2 23.11 0 top
R8  10K  [R0805]  29.46 19.43 180 top
R9  510R  [R0805]  78.87 2.67 180 top
R10  10kΩ  [RES-ADJ-TH_3P-L10.0-W10.0-P2.50-BL-BS]  22.48 17.78 180 top
R11  10K  [R0805]  29.46 13.04 0 top
R12  10K  [R0805]  44.16 15.36 0 top
R13  10K  [R0805]  44.16 18.16 180 top
R14  3.3K  [R0805]  73.8 14.87 270 top
R15  510R  [R0805]  69.41 15.27 180 top
R16  10K  [R0805]  77.34 14.95 90 top
R17  10K  [R0805]  64.03 15.21 0 top
R18  10K  [R0805]  36.19 56.77 90 top
R19  10K  [R0805]  36.19 51.44 270 top
R20  22R  [R0805]  51.03 50.68 90 top
R21  10K  [R0805]  40.56 49.89 0 top
R22  22R  [R0805]  47.97 50.66 90 top
R23  10K  [R0805]  52.09 15.71 0 top
R24  510R  [R0805]  80.84 42.72 180 top
R25  3.3K  [R0805]  73.53 39.75 0 top
R26  510R  [R0805]  71.93 24.31 270 top
R27  10K  [R0805]  73.53 37.08 180 top
R28  10K  [R0805]  73.31 54.72 90 top
R29  10K  [R0805]  73.32 50.49 270 top
RELAY1  G5V-1 DC5  [RELAY-TH_G5V-1]  84.07 15.11 90 top
RELAY2  G5V-1 DC5  [RELAY-TH_G5V-1]  83.95 30.73 270 top
SW1  SK12D07VG4  [SW-TH_SK12D07VG4]  2.2 48 270 top
U1  LM2596HVS-5.0/TR  [TO-263-5_L10.2-W8.9-P1.70-LS15.2-BR]  40.64 42.16 180 top
U2  -  [TH_PCON]  6.37 16.21 90 top
U3  SGM3204YN6G/TR  [SOT-23-6_L2.9-W1.6-P0.95-LS2.8-BR]  33.66 29.59 180 top
U4  PS2561L-1-H-A  [SOP-4_L6.5-W4.6-P2.54-LS9.6-TL]  69.6 7.37 270 top
U5  SI2301-ZE  [SOT-23-3_L2.9-W1.3-P1.90-LS2.4-BR]  64.13 9.27 90 top
U6  MAX485ESA  [SOP-8_L5.0-W4.0-P1.27-LS6.0-BL]  42.29 54.61 270 top
U7  SI2301-ZE  [SOT-23-3_L2.9-W1.3-P1.90-LS2.4-BR]  52.07 9.78 90 top
U8  PS2561L-1-H-A  [SOP-4_L6.5-W4.6-P2.54-LS9.6-TL]  76.33 24.51 90 top
U9  AT24C02  [SOP-8_L4.9-W3.9-P1.27-LS6.0-BL]  80.39 51.31 90 top
U10  STC15F2K32S2-28I-SOP28  [SOP-28_L17.9-W7.5-P1.27-LS10.3-BL]  60.83 27.18 180 top
U11  LM324DT  [SOIC-14_L8.7-W3.9-P1.27-LS6.0-BL]  36.83 15.88 270 top
X1  11.0592MHz  [HC-49US_L11.5-W4.5-P4.88]  58.32 42.26 180 top

## Footprints (pads in the part's own frame, mm; a bottom-side part is the same pattern mirrored in y, then rotated)
C0805
  rect 1.41x1.35 smd: 1(-1,0) 2(1,0)
C1206
  rect 1.485x1.728 smd: 1(-1.593,0) 2(1.593,0)
CAP-SMD_BD6.3-L6.6-W6.6-LS7.6-RD
  rect 3.5x1.2 smd: 1(-2.67,0) 2(2.67,0)
CAP-SMD_BD10.0-L10.3-W10.3-LS11.3-FD
  rect 4.5x1.65 smd: 1(-4.5,0) 2(4.5,0)
CONN-TH_2P-P5.08_DB128L-5.08-2P
  round 2.4 hole 1.6: 1(-2.54,0) 2(2.54,0)
CONN-TH_4P_DB128L-5.08-4P-GN-S
  rect 2.4x2.4 hole 1.575x1.5: 1(7.62,0)
  round 2.4 hole 1.575x1.5: 2(2.54,0) 3(-2.54,0) 4(-7.62,0)
CONN-TH_DB128L-5.08-3P
  round 2.4 hole 1.6: 1(-5.08,0) 2(0,0) 3(5.08,0)
F1812
  rect 1.407x3.499 smd: 1(-1.853,0) 2(1.853,0)
FPC-SMD_P1.00-8P_LCS-XJ-H2.5
  rect 0.6x2.2 smd: 1(-3.499,-0.943) 2(-2.499,-0.943) 3(-1.5,-0.943) 4(-0.499,-0.943) 5(0.5,-0.943) 6(1.5,-0.943) 7(2.5,-0.943) 8(3.5,-0.943)
  rect 2.6x3 smd: 9(5.85,0.943) 10(-5.85,0.943)
HC-49US_L11.5-W4.5-P4.88
  rect 1.5x1.5 hole 0.9: 1(-2.44,0)
  round 1.5 hole 0.9: 2(2.44,0)
HDR-TH_4P-P2.54-V-F
  rect 1.7x1.7 hole 1.1: 1(-3.81,0)
  round 1.7 hole 1.1: 2(-1.27,0) 3(1.27,0) 4(3.81,0)
IND-SMD_L12.0-W12.0_YPRH120X
  rect 3x5.5 smd: 1(-5,0) 2(5,0)
LED_TH-3mm
  round 1.524 hole 0.914: 1(-1.27,0) 2(1.27,0)
M2螺丝
  round 2 hole 2: 1(0,0)
R0805
  rect 1.133x1.377 smd: 1(-1,0) 2(1,0)
RELAY-TH_G5V-1
  round 2.1 hole 1.2: 1(-5.08,-2.54) 2(-2.54,-2.54) 5(5.08,-2.54) 6(5.08,2.54) 9(-2.54,2.54) 10(-5.08,2.54)
RES-ADJ-TH_3P-L10.0-W10.0-P2.50-BL-BS
  round 1.524 hole 0.762: 1(0,2.5) 2(0,0) 3(0,-2.5)
SMA_L4.3-W2.5-LS5.0-RD
  rect 2x1.593 smd: 1(-2.1,0) 2(2.1,0)
SOIC-14_L8.7-W3.9-P1.27-LS6.0-BL
  oval 0.574x2.038 smd: 1(-3.81,-2.769) 2(-2.54,-2.769) 3(-1.27,-2.769) 4(0,-2.769) 5(1.27,-2.769) 6(2.54,-2.769) 7(3.81,-2.769) 8(3.81,2.769) 9(2.54,2.769) 10(1.27,2.769) 11(0,2.769) 12(-1.27,2.769) 13(-2.54,2.769) 14(-3.81,2.769)
SOP-4_L6.5-W4.6-P2.54-LS9.6-TL
  rect 2.5x1.8 smd: 1(-4.9,1.27) 2(-4.9,-1.27) 3(4.9,-1.27) 4(4.9,1.27)
SOP-8_L4.9-W3.9-P1.27-LS6.0-BL
  oval 0.63x1.865 smd: 1(-1.905,-2.683) 2(-0.635,-2.683) 3(0.635,-2.683) 4(1.905,-2.683) 5(1.905,2.683) 6(0.635,2.683) 7(-0.635,2.683) 8(-1.905,2.683)
SOP-8_L5.0-W4.0-P1.27-LS6.0-BL
  oval 0.574x2.035 smd: 1(-1.905,-2.768) 2(-0.635,-2.768) 3(0.635,-2.768) 4(1.905,-2.768) 5(1.905,2.768) 6(0.635,2.768) 7(-0.635,2.768) 8(-1.905,2.768)
SOP-28_L17.9-W7.5-P1.27-LS10.3-BL
  oval 0.63x1.615 smd: 1(-8.255,-4.957) 2(-6.985,-4.957) 3(-5.715,-4.957) 4(-4.445,-4.957) 5(-3.175,-4.957) 6(-1.905,-4.957) 7(-0.635,-4.957) 8(0.635,-4.957) 9(1.905,-4.957) 10(3.175,-4.957) 11(4.445,-4.957) 12(5.715,-4.957) 13(6.985,-4.957) 14(8.255,-4.957) 15(8.255,4.957) 16(6.985,4.957) 17(5.715,4.957) 18(4.445,4.957) 19(3.175,4.957) 20(1.905,4.957) 21(0.635,4.957) 22(-0.635,4.957) 23(-1.905,4.957) 24(-3.175,4.957) 25(-4.445,4.957) 26(-5.715,4.957) 27(-6.985,4.957) 28(-8.255,4.957)
SOT-23-3_L2.9-W1.3-P1.90-LS2.4-BR
  rect 1.25x0.7 smd: 1(1,-0.95) 2(1,0.95) 3(-1,0)
SOT-23-6_L2.9-W1.6-P0.95-LS2.8-BR
  rect 1.1x0.6 smd: 1(1.35,-0.95) 2(1.35,0) 3(1.35,0.95) 4(-1.35,0.95) 5(-1.35,0) 6(-1.35,-0.95)
SW-TH_SK12D07VG4
  round 1.524 hole 0.914: 1(-2,0) 2(0,0) 3(2,0)
  oval 1.4x2.2 hole 0.8x1.6: 4(4.15,0) 5(-4.15,0)
TH_PCON
  round 1.5 hole 1: 1(0,0) 2(2.54,0) 3(5.08,0) 4(7.62,0)
TO-263-5_L10.2-W8.9-P1.70-LS15.2-BR
  rect 3.6x1 smd: 1(5.25,-3.4) 2(5.25,-1.7) 3(5.25,0) 4(5.25,1.7) 5(5.25,3.4)
  rect 9.2x10.668 smd: 6(-5.25,0)

## Nets
As in the schematic.

Pads without a net: SW1 3 4 5; U10 8 11 13 17 18 19 20

## Via types
v1: diameter 0.635, hole 0.381, Top Layer to Bottom Layer, 132 vias
v2: diameter 0.889, hole 0.635, Top Layer to Bottom Layer, 4 vias

## Routing (per net, layer and track width the routed paths; a pad name or vN(x,y) marks a point on that pad's centre or on a via; arc(x,y) is an arc through that point)
GND: length 65.4
  Top Layer w0.508: C19.2 53.56,38.1 v1(51.94,38.1) v1(51.94,39.19) v1(51.94,40.28) v1(51.94,41.37) v1(51.94,42.45) v1(51.94,43.54) v1(51.94,44.63) v1(51.94,45.72) v1(53,45.72) v1(54.06,45.72) v1(55.12,45.72) v1(56.18,45.72) v1(57.23,45.72) v1(58.29,45.72) v1(59.35,45.72) v1(60.41,45.72) v1(61.47,45.72) v1(62.53,45.72) v1(63.58,45.72) v1(64.64,45.72) v1(64.64,44.63) v1(64.64,43.54) v1(64.64,42.45) v1(64.64,41.37) v1(64.64,40.28) v1(64.64,39.19) v1(64.64,38.1) 62.99,38.1 C22.2 ; U10.14 v1(52.58,29.59) ; U9.3 v1(85.34,51.94) ; U9.7 U9.2 v1(85.34,50.67) ; CN5.6 55.66,6.4 55.66,4.52 ; U9.1 v1(85.34,49.4) ; 55.66,4.52 CN5.9 ; 55.66,4.52 CN5.10 ; 83.07,53.21 v1(85.34,53.21) ; v1(46.61,52.7) U6.5
  Top Layer w0.635: v1(49.53,57.91) D4.3
  vias: v1(1.65,8.83) v1(1.65,7.94) v1(2.54,8.83) v1(2.54,7.94) v1(3.43,8.83) v1(3.43,7.94) v1(21.63,24.79) v1(21.63,23.9) v1(22.52,24.79) v1(22.52,23.9) v1(23.41,24.79) v1(23.41,23.9) v1(28.32,2.73) v1(28.32,1.84) v1(29.21,2.73) v1(29.21,1.84) v1(30.1,2.73) v1(30.1,1.84) v1(45.47,3.24) v1(45.47,2.35) v1(46.35,3.24) v1(46.35,2.35) v1(47.24,3.24) v1(47.24,2.35) v1(82.68,46.42) v1(82.68,45.53) v1(83.57,46.42) v1(83.57,45.53) v1(84.46,46.42) v1(84.46,45.53) v1(90.81,3.87) v1(90.81,2.98) v1(91.69,3.87) v1(91.69,2.98) v1(92.58,3.87) v1(92.58,2.98)
VBAT: length 116.6
  Top Layer w0.508: R6.2 46.61,20.7 47.12,21.21 47.12,27.69 v1(43.31,31.5)
  Top Layer w0.635: U1.1 35.42,45.59 v1(39.62,45.59)
  Top Layer w0.965: U1.1 31.91,45.56 v1(31.88,45.59)
  Top Layer w1.016: v1(17.53,48) C1.1
  Bottom Layer w0.508: v1(39.62,45.59) 43.31,41.91 v1(43.31,31.5)
  Bottom Layer w1.016: 12.65,48 12.65,34.24 10.16,31.75 10.16,11.18 8,9.02 CN4.4 ; 12.65,48 v1(17.53,48) 29.47,48 v1(31.88,45.59) ; 12.65,48 v1(2.2,48)
VCC: length 408.8
  Top Layer w0.508: U5.2 63.19,15.05 R17.1 v1(61.21,15.21) ; 73.41,48.06 C21.1 v1(73.41,44.32) ; 73.41,48.06 73.41,49.41 R29.2 ; 73.41,48.06 73.48,48.13 v1(74.8,48.13) 76.07,49.4 U9.8 ; U3.2 30.1,29.59 28.96,28.45 C12.2 ; R28.2 74.97,55.72 v1(75.56,55.12) ; U6.8 46.23,56.52 46.61,56.9 46.61,57.45 46.27,57.78 42.36,57.78 42.35,57.77 ; v1(32,15.88) U11.4 ; C20.2 54.61,34.04 55.12,33.53 U10.12 ; v1(18.67,12.95) 18.6,12.89 16.18,12.89
  Top Layer w0.635: v1(48.75,29.08) C23.2 C20.2 ; CN5.7 54.65,18.12 v1(54.61,18.16) 51.56,18.16 51.09,17.69 R23.1 51.07,15.69 C18.1 51.12,13 U7.2 51.18,10.72 51.18,9.65 47.88,6.35 v2(38.86,6.35) H1.3 ; 27.92,26.6 18.7,26.6 18.54,26.44
  Top Layer w0.762: U2.2 6.75,19.13 C6.1 C5.1 ; v2(68.83,8.89) 70.87,10.92 U4.1 72.01,13.41 72.01,18.29 72.9,19.18 74.62,19.18 75.06,19.61 ; C11.2 23.48,30.53 C12.2 ; R21.2 42.8,51.13 42.8,57.77 R18.2 v1(34.04,57.77)
  Top Layer w0.965: U1.4 30.91,40.46 C4.1 ; 16.18,19.18 13.64,19.18 C5.1
  Top Layer w1.016: v1(17.02,10.03) 16.18,10.87 16.18,12.89 ; 16.18,12.89 16.24,12.83 ; 16.18,12.89 16.18,19.18 18.54,21.54 v2(18.54,31.62) ; 27.99,35.69 C2.2 ; 27.99,35.69 25.95,35.69 21.89,31.62 v2(18.54,31.62) ; 27.99,35.69 30.82,35.69 ; 30.82,35.69 30.82,40.47 C4.1 21.92,49.45 L1.1 18.69,56.19 D1.1 ; 30.82,35.69 C3.2 ; v2(18.54,31.62) 14.61,31.62 LED1.1
  Bottom Layer w0.508: v1(32,15.88) 29.08,15.88 26.16,12.95 v1(18.67,12.95) ; v1(74.8,48.13) 75.56,48.89 v1(75.56,55.12) ; v1(54.61,18.16) 57.56,15.21 v1(61.21,15.21)
  Bottom Layer w0.762: 43.92,44.35 49.48,49.91 67.82,49.91 v1(73.41,44.32) ; 43.92,44.35 45.09,43.18 45.09,32.75 v1(48.75,29.08) ; 43.92,44.35 39,49.27 34.04,49.27 ; v2(68.83,8.89) 66.29,6.35 v2(38.86,6.35)
  Bottom Layer w1.016: v2(18.54,31.62) 20.7,33.78 24,33.78 34.04,43.81 v1(34.04,57.77) ; v2(38.86,6.35) 29.97,6.35 26.29,10.03 v1(17.02,10.03)
VEE: length 35.7
  Top Layer w0.508: 34.23,33.47 C8.2 ; 34.23,33.47 36.58,35.81 39.24,35.81 40.26,34.8 40.26,26.54 38.99,25.27 37.08,25.27 36.44,24.63 C13.2 36.44,16.77 37.34,15.88 U11.11 ; 34.23,33.47 32.84,32.08 32.81,32.08 32.31,31.57 U3.1
0: length 134.2
  Top Layer w0.508: U4.3 68.33,6.1 v1(69.72,7.49) ; 77.13,27.35 77.6,27.81 U8.3 ; 77.13,27.35 79.38,25.1 79.38,17.99 R16.2 76.15,15.95 75.56,15.37 v1(75.56,14.1) 75.56,13.21 74.74,12.39 Q1.2 ; 77.13,27.35 76.45,26.67 74.29,26.67 72.58,28.38 Q2.2 72.58,37.03 R27.2
  Top Layer w0.635: 15.88,22.96 15.21,22.96 14.05,21.8 C9.1 11.14,21.8 C10.1 8.24,21.29 U2.3 ; 15.88,22.96 v1(15.88,21.21) ; 15.88,22.96 R2.1
  Bottom Layer w0.508: v1(69.72,7.49) 75.56,13.33 v1(75.56,14.1)
  Bottom Layer w0.635: v1(15.88,21.21) 14.35,19.69 14.35,10.03 16.51,7.87 25.15,7.87 28.45,4.57 66.8,4.57 v1(69.72,7.49)
485_RXD: length 55
  Top Layer w0.508: v1(41.4,56.52) U6.1 37.97,56.52 37.23,55.77 R18.1 ; v1(66.55,55.25) 67.44,54.36 67.44,35.81 66.55,34.92 U10.3
  Bottom Layer w0.508: v1(41.4,56.52) 65.28,56.52 v1(66.55,55.25)
485_TXD: length 50
  Top Layer w0.508: U6.4 37.97,52.7 37.72,52.45 37.72,50.29 38.1,49.91 39.54,49.91 R21.1 39.56,49.08 40.39,48.26 65.53,48.26 66.17,47.62 66.17,36.07 65.28,35.18 U10.4
ADC0: length 41.6
  Top Layer w0.508: R5.1 41.15,9.25 v1(41.15,11.18) 41.15,11.81 40.89,12.06 U11.8 ; U10.6 62.74,30.1 60.32,27.69 55.12,27.69 v1(49.53,22.1)
  Bottom Layer w0.508: v1(49.53,22.1) 49.53,12.06 48.64,11.18 v1(41.15,11.18)
ADC1: length 34.7
  Top Layer w0.508: U11.13 U11.14 40.89,19.69 41.53,20.32 41.53,25.4 v1(44.2,28.07) ; v1(61.47,33.91) U10.7
  Bottom Layer w0.508: v1(44.2,28.07) 57.15,28.07 61.47,32.39 v1(61.47,33.91)
HEAT1: length 5.3
  Top Layer w0.508: U5.3 64.02,8.38 60.96,8.38 60.65,8.07 CN5.1
HEAT2: length 3.7
  Top Layer w0.508: CN5.8 53.65,8.33 53.2,8.78 U7.3
KC1: length 8.7
  Top Layer w0.508: CN2.1 93.79,10.03 RELAY1.1
  vias: v1(86.61,9.27)
KC2: length 17.3
  Bottom Layer w0.508: RELAY2.1 81.41,35.69 90.17,26.92 v1(94.9,26.92)
KO1: length 17.1
  Top Layer w0.508: RELAY1.10 90.58,19.08 CN2.3
KO2: length 8.9
  Top Layer w0.508: CN3.3 93.63,35.81 RELAY2.10
KX1: length 15.9
  Bottom Layer w0.508: v1(81.53,20.19) RELAY1.5 88.71,20.19 CN2.2
  vias: v1(81.53,19.43)
KX2: length 16.1
  Top Layer w0.508: CN3.2 88.55,25.65 RELAY2.6 RELAY2.5
P12: length 61
  Top Layer w0.508: v1(35.94,47.5) 34.29,49.15 34.29,51.69 35.04,52.44 R19.1 36.19,53.34 36.83,53.97 U6.3 U6.2 ; U10.5 64.01,29.59 v1(64.13,29.46)
  Bottom Layer w0.508: v1(64.13,29.46) 60.71,29.46 57.91,26.67 44.07,26.67 35.94,34.8 v1(35.94,47.5)
P20: length 24.8
  Top Layer w0.508: 53.02,15.64 v1(53.02,17.14) ; 53.02,15.64 R23.2 ; 53.02,15.64 U7.1 ; U10.23 62.74,24.13 v1(63.88,25.27)
  Bottom Layer w0.508: v1(63.88,25.27) 60.2,25.27 53.02,18.09 v1(53.02,17.14)
P21: length 21.6
  Top Layer w0.508: CN5.5 56.64,6.41 56.64,18.29 59.06,20.7 63.75,20.7 64.01,20.95 U10.24
P22: length 22.2
  Top Layer w0.508: U10.25 65.28,20.07 64.9,19.69 59.44,19.69 57.66,17.91 57.66,6.41 CN5.4
P23: length 22.2
  Top Layer w0.508: U10.26 66.55,19.56 65.66,18.67 60.32,18.67 58.65,16.99 CN5.3
P24: length 22.5
  Top Layer w0.508: CN5.2 59.65,16.34 60.96,17.65 66.55,17.65 67.82,18.92 U10.27
P25: length 14.7
  Top Layer w0.508: U5.1 65.09,15.15 R17.2 65.03,16.13 65.54,16.64 67.31,16.64 69.09,18.42 U10.28
P36: length 15.4
  Top Layer w0.508: R26.1 65.63,25.31 64.77,26.16 61.21,26.16 60.2,25.15 U10.21
P37: length 15.8
  Top Layer w0.508: v1(61.47,24.26) U10.22 ; R15.1 70.36,15.32 v1(70.36,17.27)
  Bottom Layer w0.508: v1(70.36,17.27) 68.45,17.27 v1(61.47,24.26)
SCL: length 29
  Top Layer w0.508: v1(70.87,51.49) R29.1 74.99,51.49 75.44,51.94 U9.6 ; U10.2 67.82,34.29 68.71,35.18 v1(68.71,51.56)
  Bottom Layer w0.508: v1(70.87,51.49) 70.8,51.56 v1(68.71,51.56)
SDA: length 29.6
  Top Layer w0.508: 77.71,53.21 75.31,53.21 74.81,53.72 R28.1 70.48,53.72 69.85,53.09 69.85,34.67 69.09,33.91 U10.1
SN+: length 22.7
  Top Layer w0.508: U11.3 31.24,17.14 30.23,16.13 25.4,16.13 18.16,8.89 CN4.2
SN-: length 17.7
  Top Layer w0.508: U11.5 27.18,14.61 23.24,10.67 CN4.1
VRM: length 152.3
  Top Layer w0.508: 77.91,41.72 D5.1 77.91,36.77 v1(81.41,33.27) ; 77.91,41.72 77.84,41.78 73.03,41.78 72.53,41.29 R25.1 v1(70.99,39.75) ; 77.91,41.72 78.87,42.67 79.8,42.67 R24.2 ; R14.1 73.8,17.14 v1(73.15,17.78) ; 15.88,25 R2.2 ; R9.2 77.87,3.95 80.14,6.22 D3.1 82.68,6.22 84.07,7.62 84.07,10.03 RELAY1.2
  Top Layer w0.635: U2.4 7.85,23.83 9.02,25 C10.2 15.88,25 15.88,26.3 v1(16.38,26.8)
  Bottom Layer w0.508: v1(81.41,33.27) 73.15,25.02 v1(73.15,17.78) 81.41,17.78 RELAY1.2
  Bottom Layer w0.635: v1(70.99,39.75) 70.99,28.83 69.6,27.43 60.58,27.43 58.42,25.27 29.84,25.27 28.32,26.8 v1(16.38,26.8)
XTAL1: length 11
  Top Layer w0.508: X1.2 55.88,37.97 ; 55.88,37.97 C19.1 ; 55.88,37.97 55.88,36.7 57.66,34.92 U10.10
XTAL2: length 10.9
  Top Layer w0.508: X1.1 60.77,42.26 C22.1 60.83,37.81 60.83,36.7 58.93,34.8 U10.9
$1N5406: length 8
  Top Layer w1.016: CN1.1 5.1,41.3 6.1,42.29 8.84,42.29 F1.1
$1N6010: length 15.6
  Top Layer w0.965: L1.2 31.92,49.83 29.21,47.12 29.21,45.21 30.56,43.86 U1.2
$1N7874: length 9.5
  Top Layer w0.508: U3.5 36.07,29.59 v1(36.58,29.08) ; v1(31.62,26.67) 29.99,26.67 R3.2
  Bottom Layer w0.508: v1(31.62,26.67) 34.16,26.67 v1(36.58,29.08)
$1N8048: length 2.7
  Top Layer w0.508: C7.2 35.01,30.54 U3.6
$1N8053: length 5.9
  Top Layer w0.508: C7.1 34.5,27.35 33.21,28.64 U3.3
$1N8284: length 4
  Top Layer w0.965: LED1.2 R1.2
$1N8627: length 13.8
  Top Layer w1.016: D2.1 8.87,50 5.49,50 ; F1.2 6.15,46.05 5.33,46.86 5.33,49.84 5.49,50 ; 5.49,50 SW1.1
$2N2031: length 32.3
  Top Layer w0.508: 32.13,10.87 32.18,10.92 v1(33.53,10.92) ; 32.13,10.87 32.13,11.56 32.64,12.06 U11.7 ; 32.13,10.87 32.13,8.51 31.5,7.87 28.96,7.87 28.45,8.38 28.45,10.23 C16.1 R11.1 ; R12.2 45.28,15.24 v1(46.86,15.24)
  Bottom Layer w0.508: v1(46.86,15.24) 39.62,15.24 35.31,10.92 v1(33.53,10.92)
$2N2092: length 6.7
  Top Layer w0.508: U11.10 42.41,14.61 R12.1 R13.2
$2N2099: length 7.2
  Top Layer w0.508: R5.2 R4.1 42.38,13.33 U11.9
$2N2266: length 18.5
  Top Layer w0.508: U11.2 32.26,18.42 31.37,19.3 30.62,19.3 30.48,19.45 ; 30.48,19.45 R8.1 30.46,18.65 29.08,17.27 24.47,17.27 R10.1 ; 30.48,19.45 v1(30.48,23.75)
$2N2273: length 48.5
  Top Layer w0.508: 28.46,21.72 R8.2 28.46,18.67 ; 28.46,21.72 28.46,24.02 29.21,24.77 31.62,24.77 32.38,24 32.38,20.19 32.89,19.69 U11.1 ; 28.46,21.72 v1(26.67,21.72) ; v1(47.88,12.7) 45.31,12.7 R4.2
  Bottom Layer w0.508: v1(26.67,21.72) 44.7,21.72 47.88,18.54 v1(47.88,12.7)
$2N2314: length 25.7
  Top Layer w0.508: U11.6 v1(32.26,13.33) 30.76,13.33 R11.2 C16.2 v1(30.46,8.76) ; R10.2 R10.3
  Bottom Layer w0.508: R10.2 22.61,17.65 32.51,17.65 33.4,16.76 33.4,15.37 32.26,14.22 v1(32.26,13.33)
  vias: v1(32.16,13.33)
$2N3023: length 11.6
  Top Layer w0.508: 60.58,54.61 55.65,49.68 R20.1
$2N3053: length 13.8
  Top Layer w0.508: R22.1 45.85,49.66 v1(45.85,49.66)
  Bottom Layer w0.508: CN6.2 50.8,54.61 v1(45.85,49.66)
$2N3244: length 6.2
  Top Layer w0.508: U6.6 47.7,53.97 ; 47.7,53.97 47.7,51.94 R22.2 ; 47.7,53.97 48.06,53.97 D4.1
$2N3251: length 16.7
  Top Layer w0.508: U6.7 46.99,55.25 47.75,56.01 47.75,58.29 48.39,58.93 50.67,58.93 51.44,58.17 51.44,55.45 D4.2 50.48,53.15 51.03,52.6 R20.2
$2N3377: length 3
  Top Layer w0.508: R15.2 68.41,12.34 U4.2
$2N3466: length 27.3
  Top Layer w0.508: R14.2 73.79,13.86 v1(73.79,7.25) 73.79,3.43 72.82,2.47 U4.4 ; v1(79.12,13.97) 77.36,13.97 R16.1 76.64,13.25 Q1.1
  Bottom Layer w0.508: v1(79.12,13.97) 79.12,12.58 v1(73.79,7.25)
$2N4164: length 9
  Top Layer w0.508: R26.2 77.03,23.31 77.6,22.73 77.6,19.61
$2N4168: length 15.8
  Top Layer w0.508: R25.2 R27.1 74.48,37.03 74.48,34.4 74.5,34.42 75.44,34.42 76.2,35.18 77.22,35.18 78.1,34.29 78.1,33.27 75.06,30.23 U8.4
$2N4738: length 5.5
  Top Layer w0.508: LED2.1 84.07,2.67 R9.1
$2N4742: length 24.8
  Top Layer w0.508: RELAY1.9 80.39,12.57 78.74,10.92 78.74,7.94 77.02,6.22 75.69,7.55 Q1.3 ; v1(86.11,6.6) 87.5,5.21 LED2.2
  Bottom Layer w0.508: v1(86.11,6.6) 84.07,8.64 84.07,11.18 82.68,12.57 RELAY1.9
$2N4893: length 4.9
  Top Layer w0.508: LED3.1 85.93,42.72 R24.1
$2N4914: length 33.3
  Top Layer w0.508: v1(76.2,33.53) 75.07,32.4 Q2.3 ; LED3.2 82.24,39.62 D5.2 83.69,37.91 83.69,33.78 84.2,33.27 v1(86.49,33.27)
  Bottom Layer w0.508: v1(86.49,33.27) 85.47,33.27 84.58,34.16 84.58,37.34 83.44,38.48 81.15,38.48 v1(76.2,33.53)
$2N5025: length 8.3
  Top Layer w0.508: R7.1 43.2,20.73 R6.1 43.16,20.43 41.78,19.05 41.78,17.91 41.02,17.14 U11.12
$2N7138: length 37
  Top Layer w0.508: v1(34.16,9.27) 34.16,2.67 H1.1 ; v1(53.85,20.57) U10.16
  Bottom Layer w0.508: v1(53.85,20.57) 51.82,18.54 51.82,12.06 49.02,9.27 v1(34.16,9.27)
$2N7141: length 31.1
  Top Layer w0.508: H1.2 36.32,5.96 37.85,7.49 45.34,7.49 49.28,11.43 49.28,17.4 52.58,20.7 U10.15

## Copper pours and planes (outline as drawn; the poured copper is in the pictures)
GND on Top Layer: -1.14,61.21 101.35,61.21 101.35,-1.02 -1.14,-1.02
GND on Bottom Layer: -1.52,61.72 102.11,61.72 102.11,-0.63 -1.52,-0.63

Small or netless copper shapes (teardrops, artwork), in the pictures only: 305 on Top Layer, 20 on Bottom Layer

## Text on the board
Top Silkscreen Layer: T2 | T2C | VCC | GND
